# Altium schematic sheet RF1.SchDoc
size A1
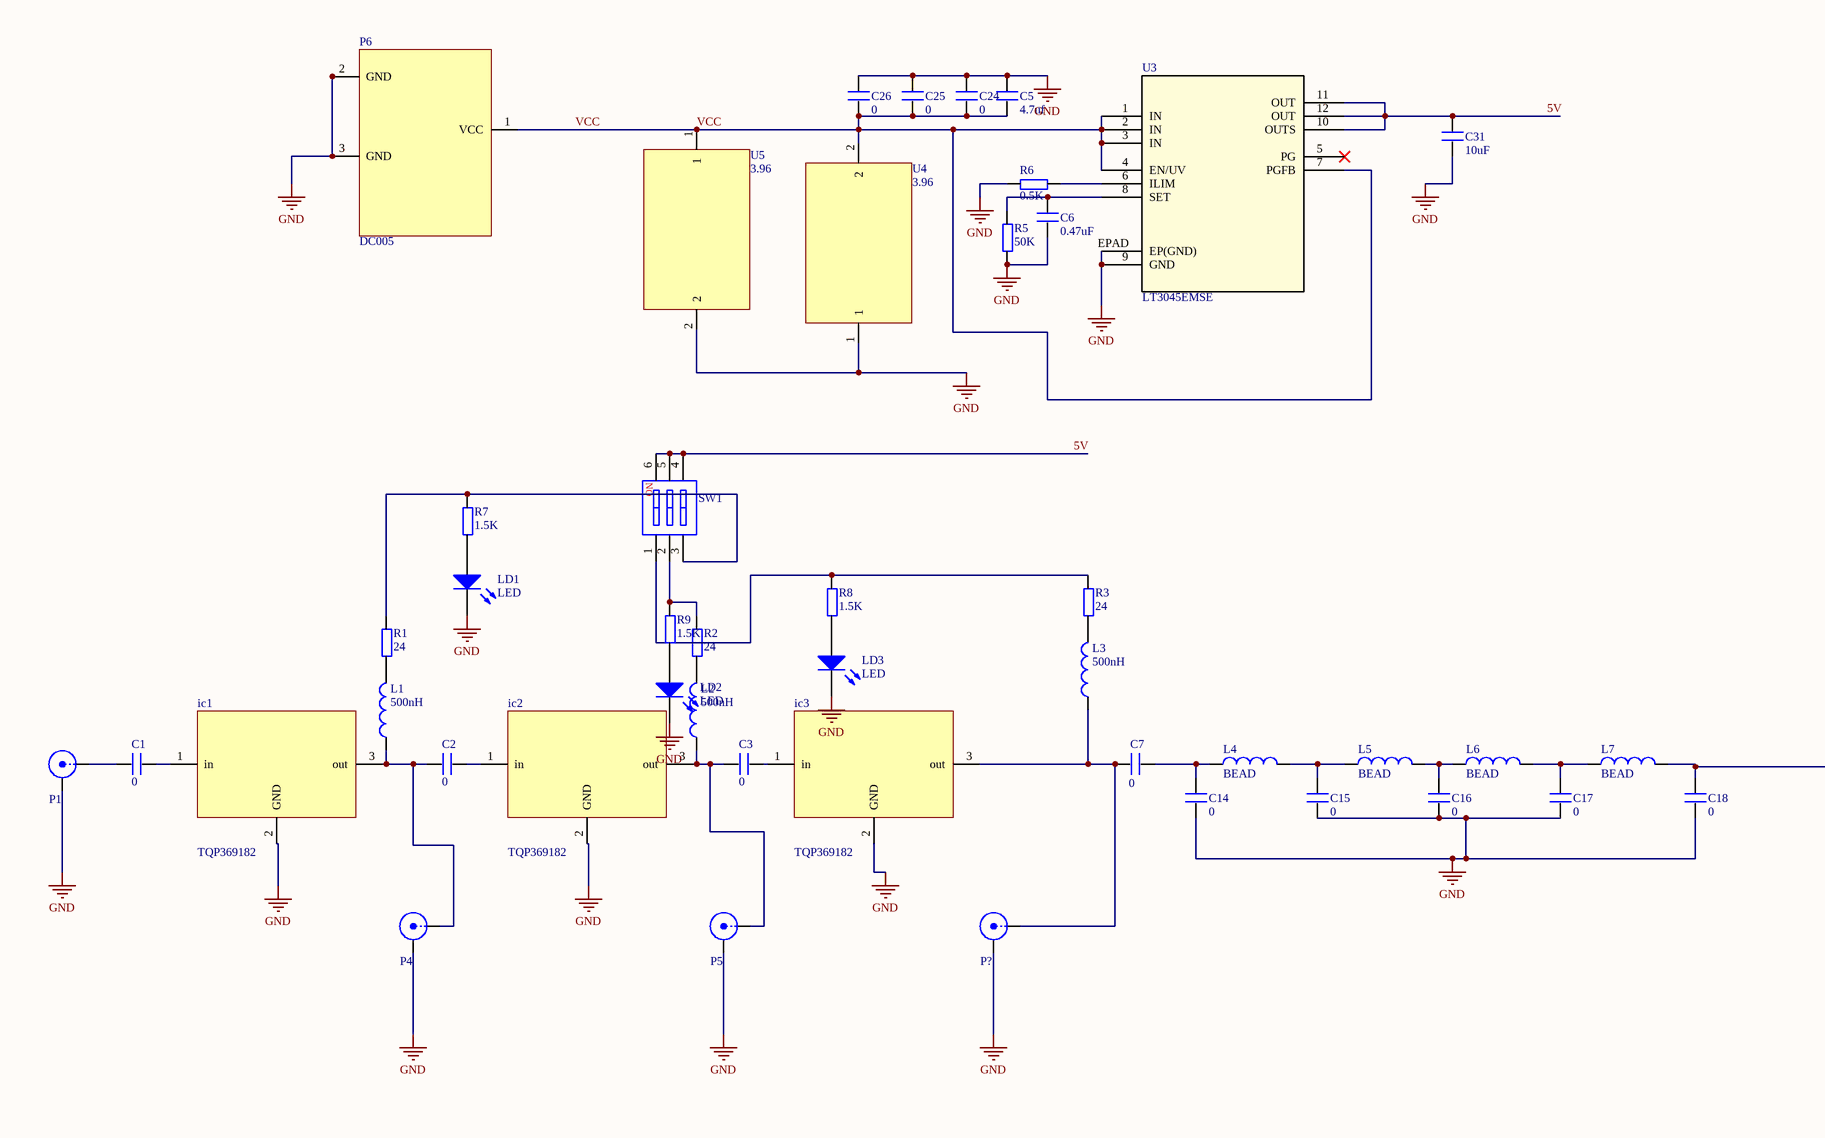
[diagram p0: RF1.SchDoc, left]
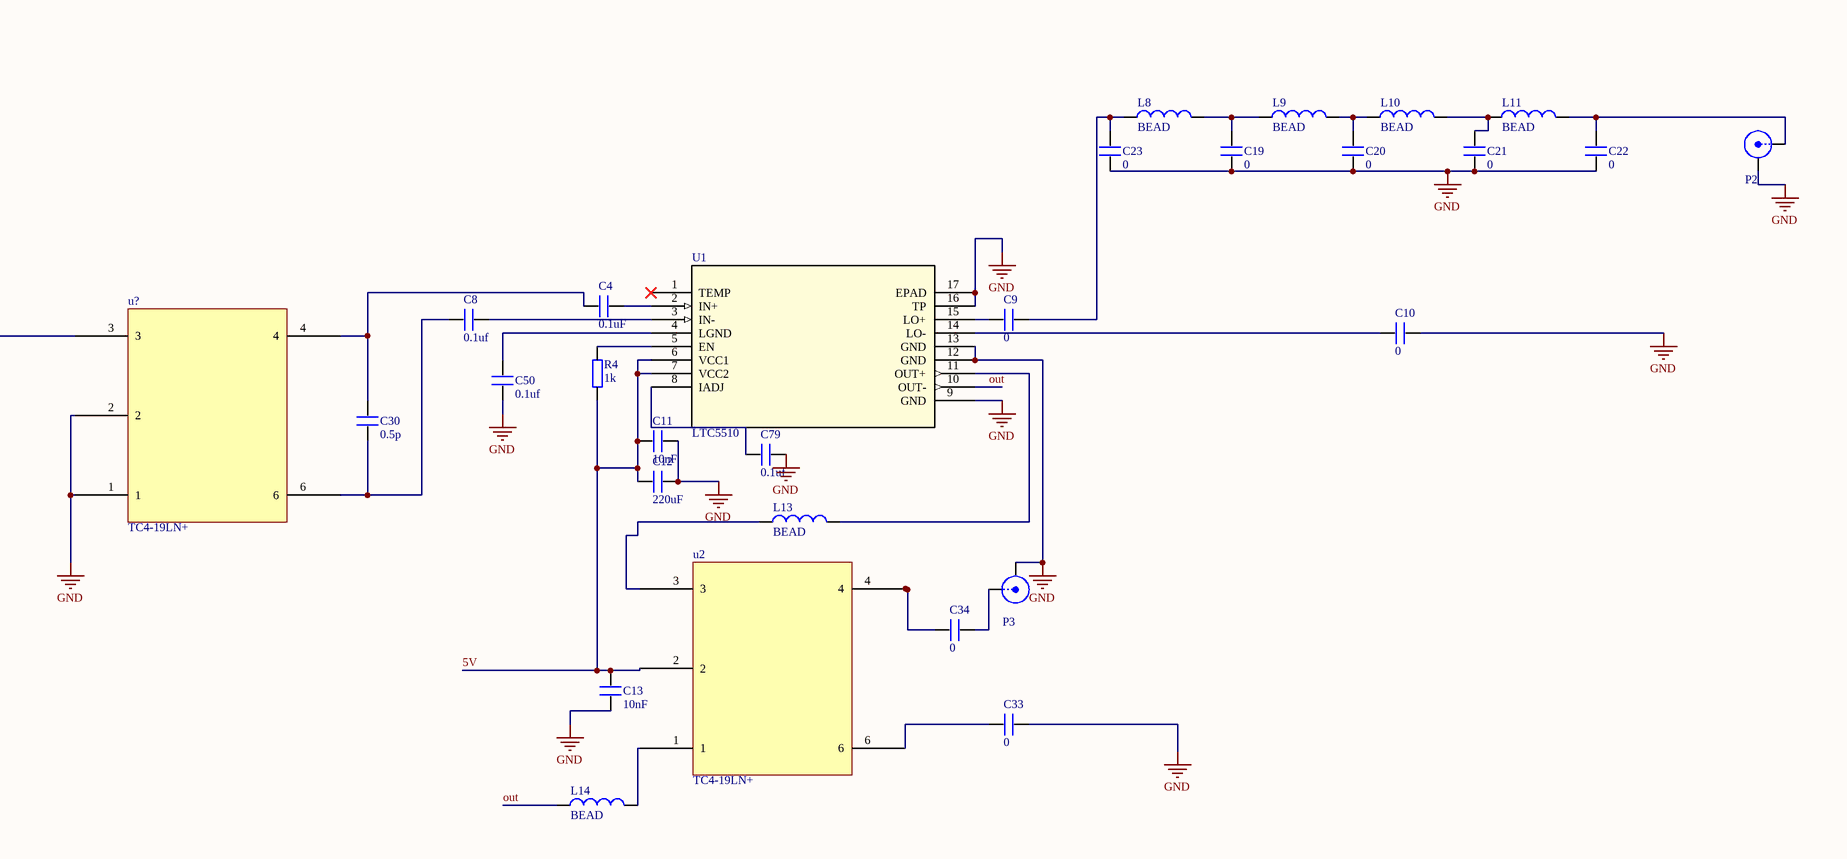
[diagram p1: RF1.SchDoc, right]

## Parts
C1  0  [0402]
C2  0  [0402]
C3  0  [0402]
C4  0.1uF  [0402]
C5  4.7uf  [0603C]
C6  0.47uF  [0402]
C7  0  [0402]
C8  0.1uf  [0402]
C9  0  [0402]
C10  0  [0402]
C11  10nF  [0402]
C12  220uF  [0402]
C13  10nF  [0402]
C14  0  [0402]
C15  0  [0402]
C16  0  [0402]
C17  0  [0402]
C18  0  [0402]
C19  0  [0402]
C20  0  [0402]
C21  0  [0402]
C22  0  [0402]
C23  0  [0402]
C24  0  [0603C]
C25  0  [CAP 1.5*4*8]
C26  0  [CAP 1.5*4*8]
C30  0.5p  [0402]
C31  10uF  [0402]
C33  0  [0402]
C34  0  [0402]
C50  0.1uf  [0402]
C79  0.1uf  [0402]
ic1  TQP369182  [SOT89_M]
ic2  TQP369182  [SOT89_M]
ic3  TQP369182  [SOT89_M]
L1  500nH  [0402]
L2  500nH  [0402]
L3  500nH  [0402]
L4  BEAD  [0402]
L5  BEAD  [0402]
L6  BEAD  [0402]
L7  BEAD  [0402]
L8  BEAD  [0402]
L9  BEAD  [0402]
L10  BEAD  [0402]
L11  BEAD  [0402]
L13  BEAD  [0603L]
L14  BEAD  [0603L]
LD1  LED  [SMDLED]
LD2  LED  [SMDLED]
LD3  LED  [SMDLED]
P1  SMA  [SMA]  (value not drawn)
P2  SMA  [SMA]  (value not drawn)
P3  SMA  [SMA]  (value not drawn)
P4  SMA  [SMA]  (value not drawn)
P5  SMA  [SMA]  (value not drawn)
P6  DC005  [DC10B]
P?  SMA  [SMA]  (value not drawn)
R1  24  [0805]
R2  24  [0805]
R3  24  [0805]
R4  1k  [0805]
R5  50K  [0402]
R6  0.5K  [0402]
R7  1.5K  [0603R]
R8  1.5K  [0603R]
R9  1.5K  [0603R]
SW1  CSW-3P_1  [CSW1.27 SMD-3P]  (value not drawn)
U1  LTC5510  [QFN-16_UF]
u2  TC4-19LN+  [AT224]
U3  LT3045EMSE  [MSOP12-MSE-RevG_ADI]
U4  3.96  [3.96]
U5  3.96  [3.96]
u?  TC4-19LN+  [AT224]

## Nets
GND: C5.2 C6.2 C10.2 C11.1 C12.1 C13.1 C14.1 C15.1 C16.1 C17.1 C18.1 C19.1 C20.1 C21.1 C22.1 C23.1 C24.2 C25.2 C26.2 C31.1 C33.2 C50.2 C79.1 ic1.2(GND) ic2.2(GND) ic3.2(GND) LD1.2(K) LD2.2(K) LD3.2(K) P1.2(Y) P2.2(Y) P3.2(Y) P4.2(Y) P5.2(Y) P6.2(GND) P6.3(GND) P?.2(Y) R5.1 R6.1 U1.9(GND) U1.12(GND) U1.13(GND) U1.16(TP) U1.17(EPAD) U3.9(GND) U3.EPAD(EP(GND)) U4.1 U5.2 u?.1 u?.2
5V: C11.2 C12.2 C13.2 C31.2 R4.1 SW1.4 SW1.5 SW1.6 U1.6(VCC1) U1.7(VCC2) u2.2 U3.10(OUTS) U3.11(OUT) U3.12(OUT)
out: L14.1 U1.10(OUT-)
VCC: C5.1 C24.1 C25.1 C26.1 P6.1(VCC) U3.1(IN) U3.2(IN) U3.3(IN) U3.4(EN/UV) U3.7(PGFB) U4.2 U5.1
NetC1_1: C1.1 P1.1(X)
NetC1_2: C1.2 ic1.1(in)
NetC2_1: C2.1 ic1.3(out) L1.1 P4.1(X)
NetC2_2: C2.2 ic2.1(in)
NetC3_1: C3.1 ic2.3(out) L2.1 P5.1(X)
NetC3_2: C3.2 ic3.1(in)
NetC4_1: C4.1 C30.2 u?.4
NetC4_2: C4.2 U1.2(IN+)
NetC6_1: C6.1 R5.2 U3.8(SET)
NetC7_1: C7.1 ic3.3(out) L3.1 P?.1(X)
NetC7_2: C7.2 C14.2 L4.1
NetC8_1: C8.1 U1.3(IN-)
NetC8_2: C8.2 C30.1 u?.6
NetC9_1: C9.1 C23.2 L8.1
NetC9_2: C9.2 U1.15(LO+)
NetC10_1: C10.1 U1.14(LO-)
NetC15_2: C15.2 L4.2 L5.1
NetC16_2: C16.2 L5.2 L6.1
NetC17_2: C17.2 L6.2 L7.1
NetC18_2: C18.2 L7.2 u?.3
NetC19_2: C19.2 L8.2 L9.1
NetC20_2: C20.2 L9.2 L10.1
NetC21_2: C21.2 L10.2 L11.1
NetC22_2: C22.2 L11.2 P2.1(X)
NetC33_1: C33.1 u2.6
NetC34_1: C34.1 u2.4
NetC34_2: C34.2 P3.1(X)
NetC50_1: C50.1 U1.4(LGND)
NetC79_2: C79.2 U1.8(IADJ)
NetL1_2: L1.2 R1.1
NetL2_2: L2.2 R2.1
NetL3_2: L3.2 R3.1
NetL13_1: L13.1 u2.3
NetL13_2: L13.2 U1.11(OUT+)
NetL14_2: L14.2 u2.1
NetLD1_1: LD1.1(A) R7.1
NetLD2_1: LD2.1(A) R9.1
NetLD3_1: LD3.1(A) R8.1
NetR1_2: R1.2 R7.2 SW1.3
NetR2_2: R2.2 R9.2 SW1.2
NetR3_2: R3.2 R8.2 SW1.1
NetR4_2: R4.2 U1.5(EN)
NetR6_2: R6.2 U3.6(ILIM)

Not connected (* = marked no-connect by the designer): U1 1(TEMP)*; U3 5(PG)*

## Notes on the sheet
- (in symbol CSW-3P_1) NO

## Library data of the parts
C1-C26 C30 C31 C33 C34 C50 C79 = C: Capacitor
L1-L11 L13 L14 = Inductor: Value: 100uH; Published: 8-Jun-2000; Revision: July-2002: Re-released for DXP Platform.; Publisher: Altium Limited
LD1-LD3 = LED: Typical RED, GREEN, YELLOW, AMBER GaAs LED; Published: 8-Jun-2000; LatestRevisionDate: 17-Jul-2002; LatestRevisionNote: Re-released for DXP Platform.; PackageDocument: Feb-2002; PackageReference: 3.2X1.6X1.1; Publisher: Altium Limited
P1-P5 P? = SMA: SMA Connector
R1-R9 = Resistor
SW1 = CSW-3P_1: 3路编码开关; 版权归属: 源创客; BOM名称: 3路编码开关; 学习资源: www.ooocke.com
U1 = LTC5510: 1MHz 至 6GHz、宽带、高线性度有源混频器; Manufacturer_Part_Number: LTC5510IUF#TRPBF; Vendor: Linear Technology; Built_By: EMA_UL_Team; Copyright: Copyright (C) 2018 Accelerated Designs. All rights reserved; RefDes: RefDes; Type: DEV; Value: Value
U3 = LT3045EMSE: No Description Available; SourceLibrary: Analog_Devices_Inc_2020-09-15; Built_By: SunStream; Vendor: Analog Devices Inc; Copyright: Copyright (C) 2018 Accelerated Designs. All rights reserved; Manufacturer_Part_Number: LT3045EMSE; RefDes: RefDes; Type: DEV